# Altium schematic sheet pcuCPU.SchDoc
size A3
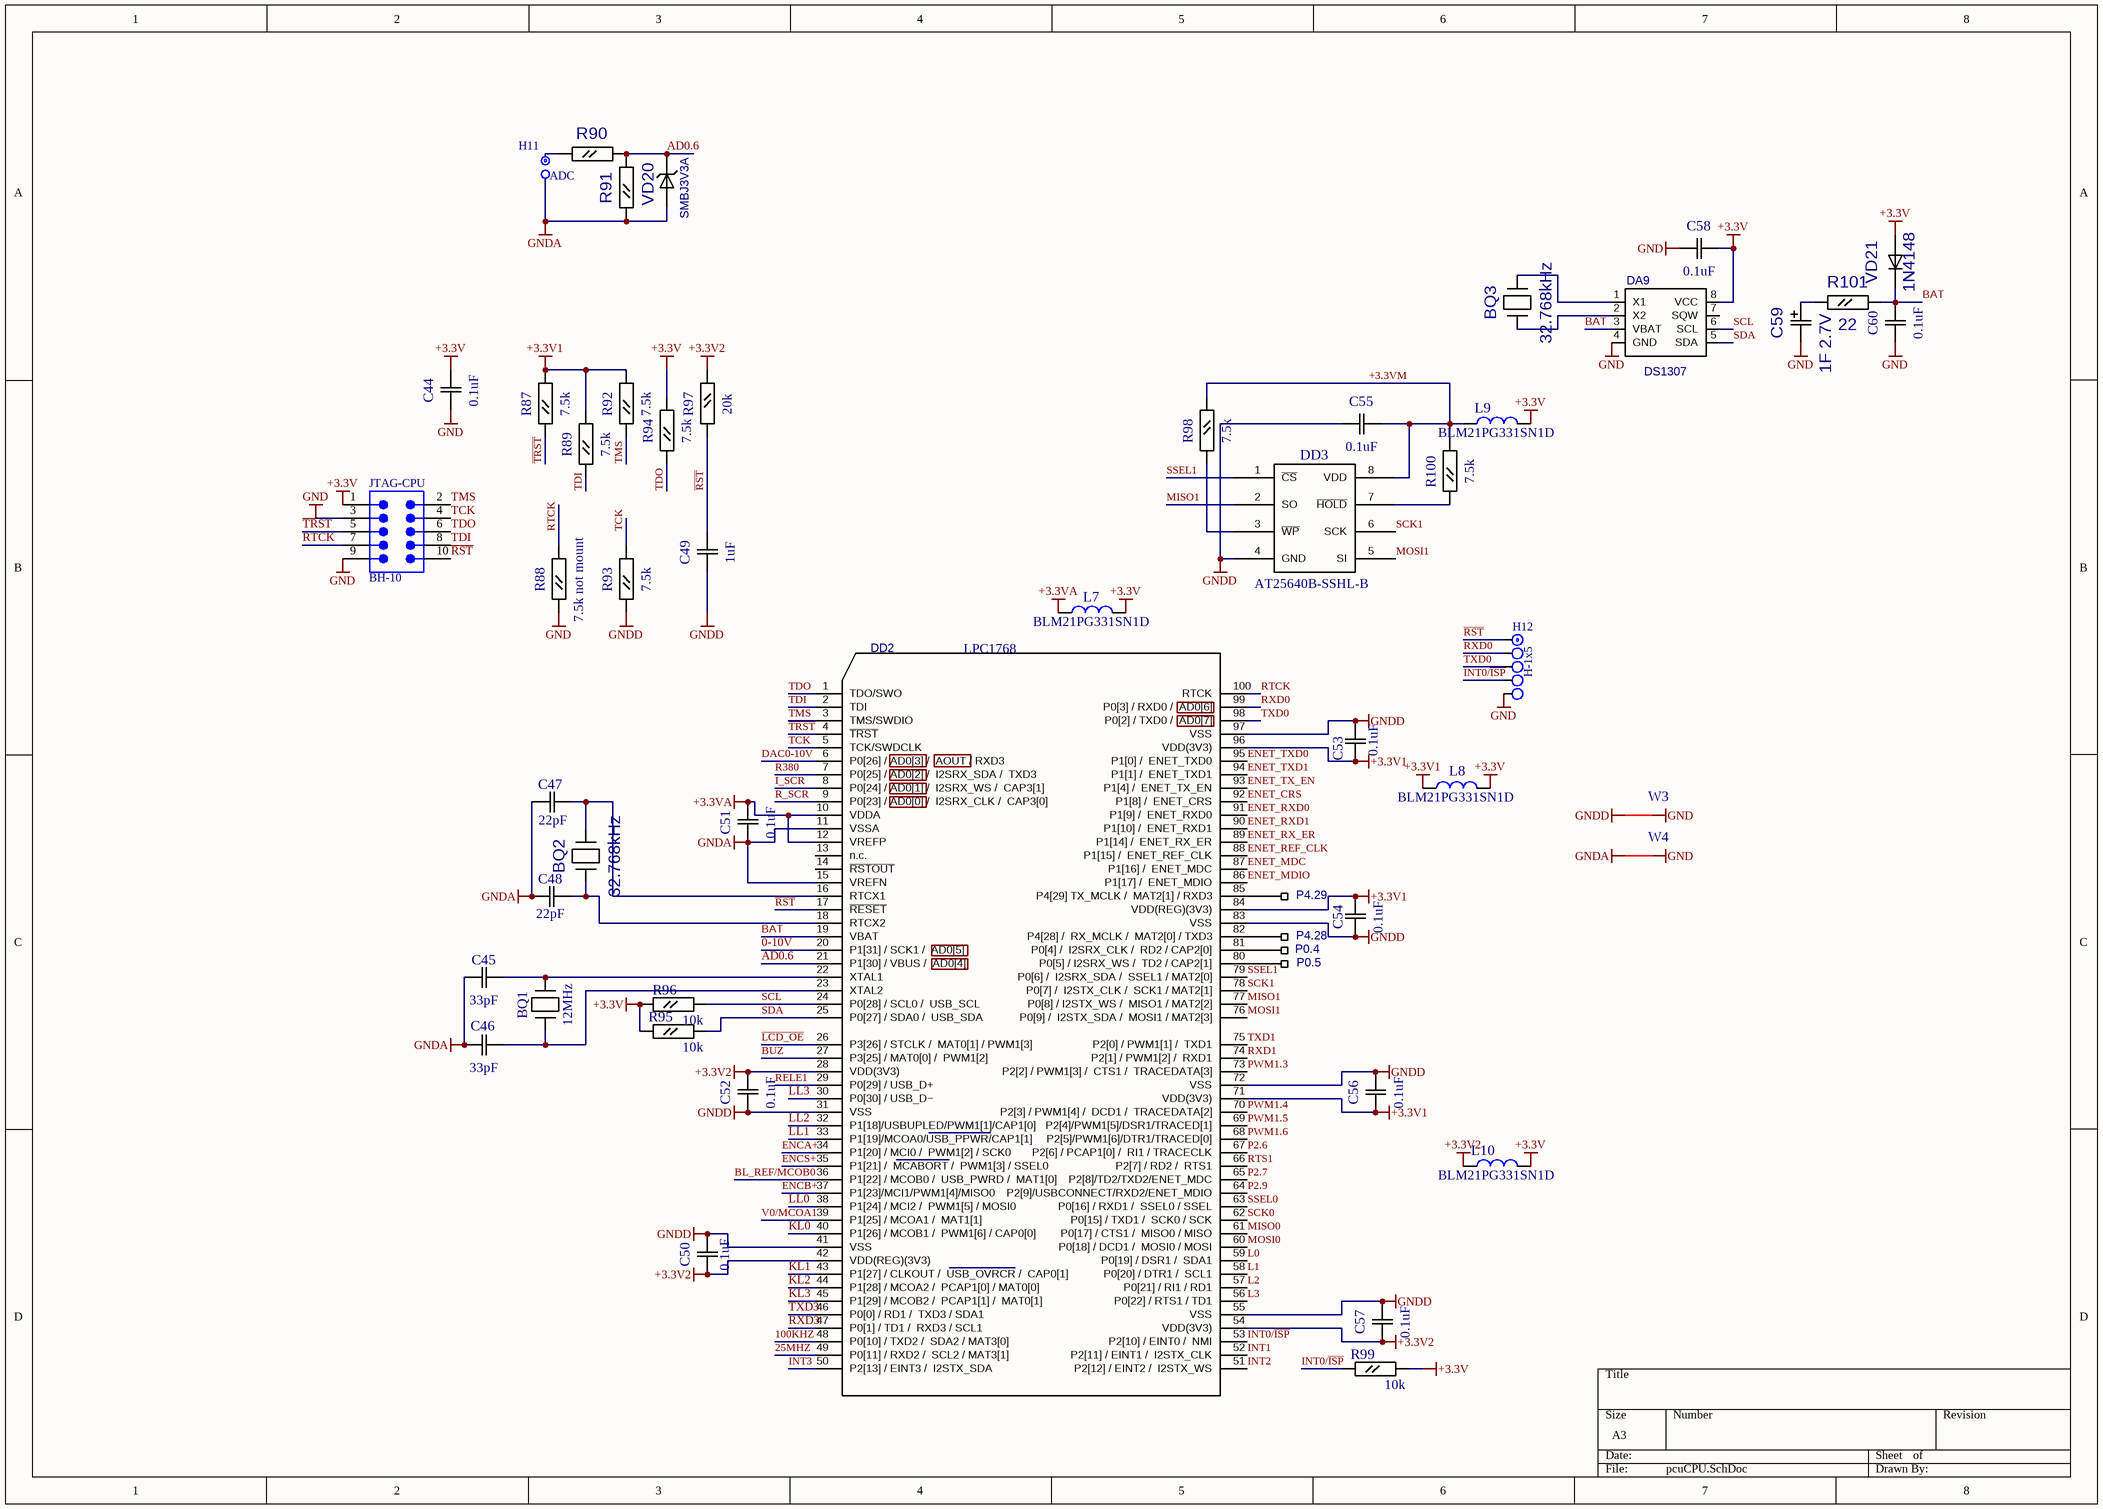
[diagram p0: pcuCPU.SchDoc]

## Parts
BQ1  value 12MHz  [HC49U]  (hidden comment: HC49_VH)
BQ2  value 32.768kHz  [R26]  (hidden comment: R26)
BQ3  value 32.768kHz  [R26smd]  (hidden comment: R26)
C44  value 0.1uF  [C0805]  (hidden comment: C0805)
C45  value 33pF  [C0805]  (hidden comment: C0805)
C46  value 33pF  [C0805]  (hidden comment: C0805)
C47  value 22pF  [C0805]  (hidden comment: C0805)
C48  value 22pF  [C0805]  (hidden comment: C0805)
C49  value 1uF  [C0805]  (hidden comment: C0805)
C50  value 0.1uF  [C0805]  (hidden comment: C0805)
C51  value 0.1uF  [C0805]  (hidden comment: C0805)
C52  value 0.1uF  [C0805]  (hidden comment: C0805)
C53  value 0.1uF  [C0805]  (hidden comment: C0805)
C54  value 0.1uF  [C0805]  (hidden comment: C0805)
C55  value 0.1uF  [C0805]  (hidden comment: C0805)
C56  value 0.1uF  [C0805]  (hidden comment: C0805)
C57  value 0.1uF  [C0805]  (hidden comment: C0805)
C58  value 0.1uF  [C0805]  (hidden comment: C0805)
C59  value 1F 2.7V  [El-d8-h12-F3.81]  (hidden comment: Cap El)
C60  value 0.1uF  [C0805]  (hidden comment: C0805)
DA9  DS1307  [SO8-1.27]
DD2  LPC1768  [QFP100-0.5MM]
DD3  value AT25640B-SSHL-B  [SO8-150]  (hidden comment: FM25L16-G)
H11  ADC  [J1x2]
H12  H-1x5  [J1x5]
JTAG-CPU  BH-10  [J2x5]
L7  BLM21PG331SN1D  [R0805]
L8  BLM21PG331SN1D  [R0805]
L9  BLM21PG331SN1D  [R0805]
L10  BLM21PG331SN1D  [R0805]
P0.4  PCB_1R  [PCB_1R_Oval]  (value not drawn)
P0.5  PCB_1R  [PCB_1R_Oval]  (value not drawn)
P4.28  PCB_1R  [PCB_1R_Oval]  (value not drawn)
P4.29  PCB_1R  [PCB_1R_Oval]  (value not drawn)
R87  value 7.5k  [R0805]  (hidden comment: R0805)
R88  value 7.5k not mount  [R0805]  (hidden comment: R0805)
R89  value 7.5k  [R0805]  (hidden comment: R0805)
R90  R0805  [R0805]  (value not drawn)
R91  R0805  [R0805]  (value not drawn)
R92  value 7.5k  [R0805]  (hidden comment: R0805)
R93  value 7.5k  [R0805]  (hidden comment: R0805)
R94  value 7.5k  [R0805]  (hidden comment: R0805)
R95  value 10k  [R0805]  (hidden comment: R0805)
R96  value 10k  [R0805]  (hidden comment: R0805)
R97  value 20k  [R0805]  (hidden comment: R0805)
R98  value 7.5k  [R0805]  (hidden comment: R0805)
R99  value 10k  [R0805]  (hidden comment: R0805)
R100  value 7.5k  [R0805]  (hidden comment: R0805)
R101  value 22  [R0805]  (hidden comment: R0805)
VD20  value SMBJ3V3A  [DO-214AA(SMB)]  (hidden comment: 10BQ100)
VD21  value 1N4148  [SOD123]  (hidden comment: DIOD_thin)
W3  Net connector  [Net connector]  (value not drawn)  (net tie, no BOM)
W4  Net connector  [Net connector0.5mm]  (value not drawn)  (net tie, no BOM)

## Nets
+3.3V: C44.2 C58.1 DA9.8(VCC) JTAG-CPU.1 L7.2 L8.2 L9.2 L10.2 R94.1 R95.2 R96.2 R99.1 VD21.2(+)
+3.3V1: C53.2 C54.2 C56.2 DD2.71(VDD(3V3)) DD2.84(VDD(REG)(3V3)) DD2.96(VDD(3V3)) L8.1 R87.1 R89.1 R92.1
+3.3V2: C50.2 C52.2 C57.2 DD2.28(VDD(3V3)) DD2.42(VDD(REG)(3V3)) DD2.54(VDD(3V3)) L10.1 R97.2
+3.3VA: C51.2 DD2.10(VDDA) DD2.12(VREFP) L7.1
GND: C44.1 C58.2 C59.2 C60.2 DA9.4(GND) H12.5 JTAG-CPU.3 JTAG-CPU.9 R88.2 W3.1 W4.1
GNDA: C45.2 C46.2 C47.1 C48.2 C51.1 DD2.11(VSSA) DD2.15(VREFN) H11.2 R91.2 VD20.2 W4.2
GNDD: C49.1 C50.1 C52.1 C53.1 C54.1 C55.2 C56.1 C57.1 DD2.31(VSS) DD2.41(VSS) DD2.55(VSS) DD2.72(VSS) DD2.83(VSS) DD2.97(VSS) DD3.4(GND) R93.2 W3.2
0-10V: DD2.20(P1[31]_/_SCK1_/__AD0[5])
25MHZ: DD2.49(P0[11]_/_RXD2_/__SCL2_/_MAT3[1])
100KHZ: DD2.48(P0[10]_/_TXD2_/__SDA2_/_MAT3[0])
+3.3VM: C55.1 DD3.8(VDD) L9.1 R98.2 R100.1
~{LCD_OE}: DD2.26(P3[26]_/_STCLK_/__MAT0[1]_/_PWM1[3])
~{TRST}: DD2.4(~{TRST}) JTAG-CPU.5 R87.2
AD0.6: DD2.21(P1[30]_/_VBUS_/__AD0[4]) R90.1 R91.1 VD20.1
BAT: C60.1 DA9.3(VBAT) DD2.19(VBAT) R101.1 VD21.1(-)
BL_REF/MCOB0: DD2.36(P1[22]_/_MCOB0_/__USB_PWRD_/__MAT1[0])
BUZ: DD2.27(P3[25]_/_MAT0[0]_/__PWM1[2])
DAC0-10V: DD2.6(P0[26]_/_AD0[3]_/__AOUT_/_RXD3)
ENCA+: DD2.34(P1[20]_/_MCI0_/__PWM1[2]_/_SCK0)
ENCB+: DD2.37(P1[23]/MCI1/PWM1[4]/MISO0)
ENCS+: DD2.35(P1[21]_/__MCABORT_/__PWM1[3]_/_SSEL0)
ENET_CRS: DD2.92(P1[8]_/__ENET_CRS)
ENET_MDC: DD2.87(P1[16]_/__ENET_MDC)
ENET_MDIO: DD2.86(P1[17]_/__ENET_MDIO)
ENET_REF_CLK: DD2.88(P1[15]_/__ENET_REF_CLK)
ENET_RX_ER: DD2.89(P1[14]_/__ENET_RX_ER)
ENET_RXD0: DD2.91(P1[9]_/__ENET_RXD0)
ENET_RXD1: DD2.90(P1[10]_/__ENET_RXD1)
ENET_TX_EN: DD2.93(P1[4]_/__ENET_TX_EN)
ENET_TXD0: DD2.95(P1[0]_/__ENET_TXD0)
ENET_TXD1: DD2.94(P1[1]_/__ENET_TXD1)
I_SCR: DD2.8(P0[24]_/_AD0[1]_/__I2SRX_WS_/__CAP3[1])
INT0/~{ISP}: DD2.53(P2[10]_/_EINT0_/__NMI) H12.4 R99.2
INT1: DD2.52(P2[11]_/_EINT1_/__I2STX_CLK)
INT2: DD2.51(P2[12]_/_EINT2_/__I2STX_WS)
INT3: DD2.50(P2[13]_/_EINT3_/__I2STX_SDA)
KL0: DD2.40(P1[26]_/_MCOB1_/__PWM1[6]_/_CAP0[0])
KL1: DD2.43(P1[27]_/_CLKOUT_/__USB_OVRCR_/__CAP0[1])
KL2: DD2.44(P1[28]_/_MCOA2_/__PCAP1[0]_/_MAT0[0])
KL3: DD2.45(P1[29]_/_MCOB2_/__PCAP1[1]_/__MAT0[1])
L0: DD2.59(P0[19]_/_DSR1_/__SDA1)
L1: DD2.58(P0[20]_/_DTR1_/__SCL1)
L2: DD2.57(P0[21]_/_RI1_/_RD1)
L3: DD2.56(P0[22]_/_RTS1_/_TD1)
LL0: DD2.38(P1[24]_/_MCI2_/__PWM1[5]_/_MOSI0)
LL1: DD2.33(P1[19]/MCOA0/USB_PPWR/CAP1[1])
LL2: DD2.32(P1[18]/USBUPLED/PWM1[1]/CAP1[0])
LL3: DD2.30(P0[30]_/_USB_D−)
MISO0: DD2.61(P0[17]_/_CTS1_/__MISO0_/_MISO)
MISO1: DD2.77(P0[8]_/_I2STX_WS_/__MISO1_/_MAT2[2]) DD3.2(SO)
MOSI0: DD2.60(P0[18]_/_DCD1_/__MOSI0_/_MOSI)
MOSI1: DD2.76(P0[9]_/__I2STX_SDA_/__MOSI1_/_MAT2[3]) DD3.5(SI)
P2.6: DD2.67(P2[6]_/_PCAP1[0]_/__RI1_/_TRACECLK)
P2.7: DD2.65(P2[8]/TD2/TXD2/ENET_MDC)
P2.9: DD2.64(P2[9]/USBCONNECT/RXD2/ENET_MDIO)
PWM1.3: DD2.73(P2[2]_/_PWM1[3]_/__CTS1_/__TRACEDATA[3])
PWM1.4: DD2.70(P2[3]_/_PWM1[4]_/__DCD1_/__TRACEDATA[2])
PWM1.5: DD2.69(P2[4]/PWM1[5]/DSR1/TRACED[1])
PWM1.6: DD2.68(P2[5]/PWM1[6]/DTR1/TRACED[0])
R380: DD2.7(P0[25]_/_AD0[2]_/__I2SRX_SDA_/__TXD3)
~{RST}: C49.2 DD2.17(~{RESET}) H12.1 JTAG-CPU.10 R97.1
R_SCR: DD2.9(P0[23]_/_AD0[0]_/__I2SRX_CLK_/__CAP3[0])
RELE1: DD2.29(P0[29]_/_USB_D+)
RTCK: DD2.100(RTCK) JTAG-CPU.7 R88.1
RTS1: DD2.66(P2[7]_/_RD2_/__RTS1)
RXD0: DD2.99(P0[3]_/_RXD0_/__AD0[6]) H12.2
RXD1: DD2.74(P2[1]_/_PWM1[2]_/__RXD1)
RXD3: DD2.47(P0[1]_/_TD1_/__RXD3_/_SCL1)
SCK0: DD2.62(P0[15]_/_TXD1_/__SCK0_/_SCK)
SCK1: DD2.78(P0[7]_/__I2STX_CLK_/__SCK1_/_MAT2[1]) DD3.6(SCK)
SCL: DA9.6(SCL) DD2.24(P0[28]_/_SCL0_/__USB_SCL) R96.1
SDA: DA9.5(SDA) DD2.25(P0[27]_/_SDA0_/__USB_SDA) R95.1
SSEL0: DD2.63(P0[16]_/_RXD1_/__SSEL0_/_SSEL)
SSEL1: DD2.79(P0[6]_/__I2SRX_SDA_/__SSEL1_/_MAT2[0]) DD3.1(~{CS})
TCK: DD2.5(TCK/SWDCLK) JTAG-CPU.4 R93.1
TDI: DD2.2(TDI) JTAG-CPU.8 R89.2
TDO: DD2.1(TDO/SWO) JTAG-CPU.6 R94.2
TMS: DD2.3(TMS/SWDIO) JTAG-CPU.2 R92.2
TXD0: DD2.98(P0[2]_/_TXD0_/__AD0[7]) H12.3
TXD1: DD2.75(P2[0]_/_PWM1[1]_/__TXD1)
TXD3: DD2.46(P0[0]_/_RD1_/__TXD3_/_SDA1)
V0/MCOA1: DD2.39(P1[25]_/_MCOA1_/__MAT1[1])
NetBQ1_1: BQ1.1 C45.1 DD2.22(XTAL1)
NetBQ1_2: BQ1.2 C46.1 DD2.23(XTAL2)
NetBQ2_1: BQ2.1 C48.1 DD2.18(RTCX2)
NetBQ2_2: BQ2.2 C47.2 DD2.16(RTCX1)
NetBQ3_1: BQ3.1 DA9.2(X2)
NetBQ3_2: BQ3.2 DA9.1(X1)
NetC59_1: C59.1 R101.2
NetDD2_80: DD2.80(P0[5]_/_I2SRX_WS_/__TD2_/_CAP2[1]) P0.5.1
NetDD2_81: DD2.81(P0[4]_/__I2SRX_CLK_/__RD2_/_CAP2[0]) P0.4.1
NetDD2_82: DD2.82(P4[28]_/__RX_MCLK_/__MAT2[0]_/_TXD3) P4.28.1
NetDD2_85: DD2.85(P4[29]_TX_MCLK_/__MAT2[1]_/_RXD3) P4.29.1
NetDD3_3: DD3.3(~{WP}) R98.1
NetDD3_7: DD3.7(~{HOLD}) R100.2
NetH11_1: H11.1 R90.2

Not connected (* = marked no-connect by the designer): DA9 7(SQW); DD2 13(n.c.) 14(~{RSTOUT})

## Library data of the parts
BQ1 = HC49_VH: RefDes2: {RefDes2}
BQ2 BQ3 = R26: RefDes2: {RefDes2}
C44-C58 C60 = C0805: RefDes2: {RefDes2}
C59 = Cap El: RefDes2: {RefDes2}
DD2 = LPC176_: Value: {Value}; RefDes2: {RefDes2}
DD3 = FM25L16-G: RefDes2: {RefDes2}
H11 = H-1x2
JTAG-CPU = BH-10: Flat Cable Connector (IDC), PCB Transition Connector, 2 Rows, Solder Pin, 10 Contacts; PCB_Layout: Complies with manufacturer's recommendation.; DrillSize: Corresponds to nominal value.; Published: 15-Nov-2004; DatasheetDocument: Sep-2003; PackageDocument: 26-Nov-2003; PackageReference: 9181109621; Publisher: Altium Limited; ComponentLink1Description: Manufacturer Link; ComponentLink1URL: http://www.harting.com/; ComponentLink2Description: Selection Guide; ComponentLink2URL: http://www.harting.com/imperia/md/content/steckverbinderundsystemkomponenten/folder/interface_engl_chapter_09.pdf
L7-L10 = BLM21PG331SN1D: Ferrite beads; Value: BLM21PG331SN1D
R87-R101 = R0805: RefDes2: {RefDes2}
VD20 = 10BQ100: RefDes2: {RefDes2}
VD21 = DIOD_thin: DIOD 1N4148; RefDes2: {RefDes2}
DA9 = DS1307: Value: *
H12 = H-1x5: Price: 0.05